# Altium schematic sheet Display Alt.SchDoc
size A; SheetNumber: 4; SheetTotal: 5
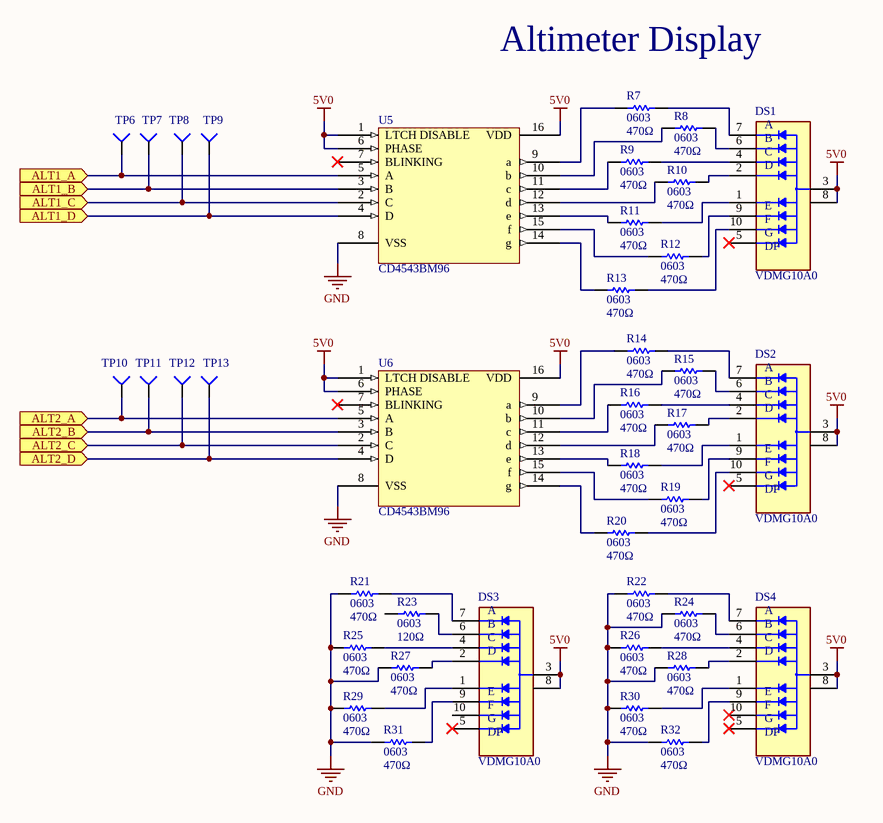
[diagram p0: Display Alt.SchDoc]

## Parts
DS1  VDMG10A0  [DISPLAY_VDMG10A0]
DS2  VDMG10A0  [DISPLAY_VDMG10A0]
DS3  VDMG10A0  [DISPLAY_VDMG10A0]
DS4  VDMG10A0  [DISPLAY_VDMG10A0]
R7  value 470Ω  Footprint Size: 0603  [RES0603]  (hidden comment: 470R 1%)
R8  value 470Ω  Footprint Size: 0603  [RES0603]  (hidden comment: 470R 1%)
R9  value 470Ω  Footprint Size: 0603  [RES0603]  (hidden comment: 470R 1%)
R10  value 470Ω  Footprint Size: 0603  [RES0603]  (hidden comment: 470R 1%)
R11  value 470Ω  Footprint Size: 0603  [RES0603]  (hidden comment: 470R 1%)
R12  value 470Ω  Footprint Size: 0603  [RES0603]  (hidden comment: 470R 1%)
R13  value 470Ω  Footprint Size: 0603  [RES0603]  (hidden comment: 470R 1%)
R14  value 470Ω  Footprint Size: 0603  [RES0603]  (hidden comment: 470R 1%)
R15  value 470Ω  Footprint Size: 0603  [RES0603]  (hidden comment: 470R 1%)
R16  value 470Ω  Footprint Size: 0603  [RES0603]  (hidden comment: 470R 1%)
R17  value 470Ω  Footprint Size: 0603  [RES0603]  (hidden comment: 470R 1%)
R18  value 470Ω  Footprint Size: 0603  [RES0603]  (hidden comment: 470R 1%)
R19  value 470Ω  Footprint Size: 0603  [RES0603]  (hidden comment: 470R 1%)
R20  value 470Ω  Footprint Size: 0603  [RES0603]  (hidden comment: 470R 1%)
R21  value 470Ω  Footprint Size: 0603  [RES0603]  (hidden comment: 470R 1%)
R22  value 470Ω  Footprint Size: 0603  [RES0603]  (hidden comment: 470R 1%)
R23  value 120Ω  Package/Footprint: 0603  [RES0603]  (hidden comment: RES_120Ω_0603)
R24  value 470Ω  Footprint Size: 0603  [RES0603]  (hidden comment: 470R 1%)
R25  value 470Ω  Footprint Size: 0603  [RES0603]  (hidden comment: 470R 1%)
R26  value 470Ω  Footprint Size: 0603  [RES0603]  (hidden comment: 470R 1%)
R27  value 470Ω  Footprint Size: 0603  [RES0603]  (hidden comment: 470R 1%)
R28  value 470Ω  Footprint Size: 0603  [RES0603]  (hidden comment: 470R 1%)
R29  value 470Ω  Footprint Size: 0603  [RES0603]  (hidden comment: 470R 1%)
R30  value 470Ω  Footprint Size: 0603  [RES0603]  (hidden comment: 470R 1%)
R31  value 470Ω  Footprint Size: 0603  [RES0603]  (hidden comment: 470R 1%)
R32  value 470Ω  Footprint Size: 0603  [RES0603]  (hidden comment: 470R 1%)
TP6  TESTPT  [TESTPT SQUARE]  (value not drawn)
TP7  TESTPT  [TESTPT SQUARE]  (value not drawn)
TP8  TESTPT  [TESTPT SQUARE]  (value not drawn)
TP9  TESTPT  [TESTPT SQUARE]  (value not drawn)
TP10  TESTPT  [TESTPT SQUARE]  (value not drawn)
TP11  TESTPT  [TESTPT SQUARE]  (value not drawn)
TP12  TESTPT  [TESTPT SQUARE]  (value not drawn)
TP13  TESTPT  [TESTPT SQUARE]  (value not drawn)
U5  CD4543BM96  [SOIC127P600X175-16N]
U6  CD4543BM96  [SOIC127P600X175-16N]

## Ports
ALT1_A (in), ALT1_B (in), ALT1_C (in), ALT1_D (in), ALT2_A (in), ALT2_B (in), ALT2_C (in), ALT2_D (in)

## Nets
5V0: DS1.3(ANODE) DS1.8(ANODE) DS2.3(ANODE) DS2.8(ANODE) DS3.3(ANODE) DS3.8(ANODE) DS4.3(ANODE) DS4.8(ANODE) U5.1(LTCH_DISABLE) U5.6(PHASE) U5.16(VDD) U6.1(LTCH_DISABLE) U6.6(PHASE) U6.16(VDD)
GND: R21.1 R22.1 R24.1 R25.1 R26.1 R27.1 R28.1 R29.1 R30.1 R31.1 R32.1 U5.8(VSS) U6.8(VSS)
ALT1_A: TP6.1(=value) U5.5(A) ; port ALT1_A
ALT1_B: TP7.1(=value) U5.3(B) ; port ALT1_B
ALT1_C: TP8.1(=value) U5.2(C) ; port ALT1_C
ALT1_D: TP9.1(=value) U5.4(D) ; port ALT1_D
ALT2_A: TP10.1(=value) U6.5(A) ; port ALT2_A
ALT2_B: TP11.1(=value) U6.3(B) ; port ALT2_B
ALT2_C: TP12.1(=value) U6.2(C) ; port ALT2_C
ALT2_D: TP13.1(=value) U6.4(D) ; port ALT2_D
NetDS1_1: DS1.1(E) R11.2
NetDS1_2: DS1.2(D) R10.2
NetDS1_4: DS1.4(C) R9.2
NetDS1_6: DS1.6(B) R8.2
NetDS1_7: DS1.7(A) R7.2
NetDS1_9: DS1.9(F) R12.2
NetDS1_10: DS1.10(G) R13.2
NetDS2_1: DS2.1(E) R18.2
NetDS2_2: DS2.2(D) R17.2
NetDS2_4: DS2.4(C) R16.2
NetDS2_6: DS2.6(B) R15.2
NetDS2_7: DS2.7(A) R14.2
NetDS2_9: DS2.9(F) R19.2
NetDS2_10: DS2.10(G) R20.2
NetDS3_1: DS3.1(E) R29.2
NetDS3_2: DS3.2(D) R27.2
NetDS3_4: DS3.4(C) R25.2
NetDS3_6: DS3.6(B) R23.2
NetDS3_7: DS3.7(A) R21.2
NetDS3_9: DS3.9(F) R31.2
NetDS4_1: DS4.1(E) R30.2
NetDS4_2: DS4.2(D) R28.2
NetDS4_4: DS4.4(C) R26.2
NetDS4_6: DS4.6(B) R24.2
NetDS4_7: DS4.7(A) R22.2
NetDS4_9: DS4.9(F) R32.2
NetR7_1: R7.1 U5.9(a)
NetR8_1: R8.1 U5.10(b)
NetR9_1: R9.1 U5.11(c)
NetR10_1: R10.1 U5.12(d)
NetR11_1: R11.1 U5.13(e)
NetR12_1: R12.1 U5.15(f)
NetR13_1: R13.1 U5.14(g)
NetR14_1: R14.1 U6.9(a)
NetR15_1: R15.1 U6.10(b)
NetR16_1: R16.1 U6.11(c)
NetR17_1: R17.1 U6.12(d)
NetR18_1: R18.1 U6.13(e)
NetR19_1: R19.1 U6.15(f)
NetR20_1: R20.1 U6.14(g)

Not connected (* = marked no-connect by the designer): DS1 5(DP)*; DS2 5(DP)*; DS3 5(DP)* 10(G); DS4 5(DP)* 10(G)*; R23 1; U5 7(BLINKING)*; U6 7(BLINKING)*

## Notes on the sheet
- Altimeter Display

## Library data of the parts
DS1-DS4 = 7 SEG DISPLAY - VDMG10A0: Smart/Normal 7 Seg Numeric LED Display; Manufacturer: Vishay Semiconductors; Package: SMD-10 Vishay; MP: VDMG10A0; Supplier 1: Digi-Key; Manufacturer Part Number: VDMG10A0; RoHS: Yes; Category: LED Displays; Stock 1: 6191; Pricing 1: 1=1.55000, 10=1.38200, 100=1.07760 (USD); Optoelectronic Device Type: SMART/NORMAL 7 SEG NUMERIC LED DISPLAY; REACH SVHC: No SVHC; RoHS Compliant: Yes; ComponentLink1URL: https://datasheet.ciiva.com:443/pdfs/VipMasterIC/IC/VISH/VISH-S-A0001108912/VISH-S-A0001108912-1.pdf?src-supplier=IHS+Markit; ComponentLink1Description: https://datasheet.ciiva.com:443/pdfs/VipMasterIC/IC/VISH/VISH-S-A0001108912/VISH-S-A0001108912-1.pdf?src-supplier=IHS+Markit; ComponentLink2URL: https://datasheet.ciiva.com/24075/vdmx10x0-272413-24075313.pdf?src-supplier=Mouser; ComponentLink2Description: https://datasheet.ciiva.com/24075/vdmx10x0-272413-24075313.pdf?src-supplier=Mouser; ComponentLink3URL: https://datasheet.ciiva.com/23867/vdmx10x0-23867376.pdf?src-supplier=Newark; ComponentLink3Description: https://datasheet.ciiva.com/23867/vdmx10x0-23867376.pdf?src-supplier=Newark; ComponentLink4URL: https://datasheet.ciiva.com/29566/vdmx10x0-29566054.pdf?src-supplier=Digi-Key; ComponentLink4Description: https://datasheet.ciiva.com/29566/vdmx10x0-29566054.pdf?src-supplier=Digi-Key; ComponentLink5URL: https://datasheet.ciiva.com/29566/vdmx10x0-29566055.pdf?src-supplier=Digi-Key; ComponentLink5Description: https://datasheet.ciiva.com/29566/vdmx10x0-29566055.pdf?src-supplier=Digi-Key; ComponentLink6URL: https://datasheet.ciiva.com/29566/vdmx10x0-29566056.pdf?src-supplier=Digi-Key; ComponentLink6Description: https://datasheet.ciiva.com/29566/vdmx10x0-29566056.pdf?src-supplier=Digi-Key; ComponentLink7URL: https://datasheet.ciiva.com/30017/vdmx10x0-30017276.pdf?src-supplier=Avnet; ComponentLink7Description: https://datasheet.ciiva.com/30017/vdmx10x0-30017276.pdf?src-supplier=Avnet; ComponentLink8URL: https://datasheet.ciiva.com/23867/1809851-23867367.pdf?src-supplier=Newark; ComponentLink8Description: https://datasheet.ciiva.com/23867/1809851-23867367.pdf?src-supplier=Newark; ComponentLink9URL: https://datasheet.ciiva.com/22726/1913356-22726255.pdf?src-supplier=Element14; ComponentLink9Description: https://datasheet.ciiva.com/22726/1913356-22726255.pdf?src-supplier=Element14; ComponentLink10URL: https://datasheet.ciiva.com/24208/vdmx10x0-24208888.pdf?src-supplier=Future+Electronics; ComponentLink10Description: https://datasheet.ciiva.com/24208/vdmx10x0-24208888.pdf?src-supplier=Future+Electronics; Supplier Part Number 1: VDMG10A0CT-ND
R7-R22 R24-R32 = RES_470Ω_0603_1%: RES 470 OHM 1% 1/10W 0603; Manufacturer 1: Yageo; Manufacturer Part Number 1: RC0603FR-07470RL; Supplier Part Number 1: 311-470HRCT-ND; Supplier 1: Digi-Key
R23 = RES_120Ω_0603_5%: RES 120 OHM 5% 1/10W 0603; Manufacturer 1: Yageo; Manufacturer Part Number 1: RC0603JR-07120RL; Supplier Part Number 1: 311-120GRCT-ND; Supplier 1: Digi-Key; Mounting Type: SMD
TP6-TP13 = TESTPT SQUARE
U5 U6 = 7 SEG DISPLAY IC: Seven Segment Decoder/Driver, 4000/14000/40000 Series, Configurable Output, CMOS, PDSO16; Manufacturer: Texas Instruments; Package Body Material: Plastic; Input Conditioning: LATCHED; Number of Functions: 1; Propagation Delay (tpd): 1200ns; Supply Voltage-Max (Vsup): 18V; Supply Voltage-Min (Vsup): 3V; Supply Voltage-Nom (Vsup): 5V; Qualification Status: Not Qualified; Supplier 1: Digi-Key; RoHS: Yes; Category: Decoders and Multiplexers; Stock 1: 1242; Pricing 1: 1=0.44000, 10=0.37800, 25=0.35240, 100=0.28200, 250=0.26184, 500=0.22154, 1000=0.17119 (USD); Package Code: SOP; Number of Pins: 16; Package Shape: Rectangular; Terminal Finish: Nickel; Min Operating Temperature: -55°C; Max Operating Temperature: 125°C; JESD-609 Code: e4; Output Polarity: Configurable; JESD-30 Code: R-PDSO-G16; Logic IC Type: SEVEN SEGMENT DECODER/DRIVER; Moisture Sensitivity Level: 1; Package Style: SMALL OUTLINEMeter; Peak Reflow Temperature (Cel): 260°C; Surface Mount: Yes; Technology: CMOS; Terminal Form: Gull Wing; Terminal Position: DUAL; Length: 9.9mm; Width: 3.9mm; Height - Seated (Max): 1.75mm; Terminal Pitch: 1.27mm; Temperature Grade: MILITARY; REACH SVHC: Yes; RoHS Compliant: Yes; ComponentLink1URL: https://www.ti.com:443/lit/ds/symlink/cd4543b.pdf?src-supplier=IHS+Markit; ComponentLink1Description: https://www.ti.com:443/lit/ds/symlink/cd4543b.pdf?src-supplier=IHS+Markit; ComponentLink2URL: https://datasheet.ciiva.com/15092/getdatasheetpartid-635761-15092907.pdf?src-supplier=Verical; ComponentLink2Description: https://datasheet.ciiva.com/15092/getdatasheetpartid-635761-15092907.pdf?src-supplier=Verical; ComponentLink3URL: https://datasheet.ciiva.com/41457/001013540-da-01-en-ic-bcd-7seg-ltch-cd4543bm96-soic-16-tid-41457278.pdf?src-supplier=Conrad; ComponentLink3Description: https://datasheet.ciiva.com/41457/001013540-da-01-en-ic-bcd-7seg-ltch-cd4543bm96-soic-16-tid-41457278.pdf?src-supplier=Conrad; ComponentLink4URL: https://datasheet.ciiva.com/6612/cd4543b-6612264.pdf?src-supplier=Digi-Key; ComponentLink4Description: https://datasheet.ciiva.com/6612/cd4543b-6612264.pdf?src-supplier=Digi-Key; ComponentLink5URL: https://datasheet.ciiva.com/6612/cd4543b-6612265.pdf?src-supplier=Digi-Key; ComponentLink5Description: https://datasheet.ciiva.com/6612/cd4543b-6612265.pdf?src-supplier=Digi-Key; ComponentLink6URL: https://datasheet.ciiva.com/6612/cd4543b-6612267.pdf?src-supplier=Digi-Key; ComponentLink6Description: https://datasheet.ciiva.com/6612/cd4543b-6612267.pdf?src-supplier=Digi-Key; Supplier Part Number 1: 296-31539-1-ND; Manufacturer Part Number: CD4543BM96